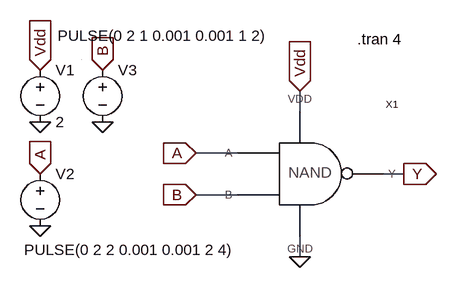
[diagram p0: schematic NAND_SYM_TESTING.asc]
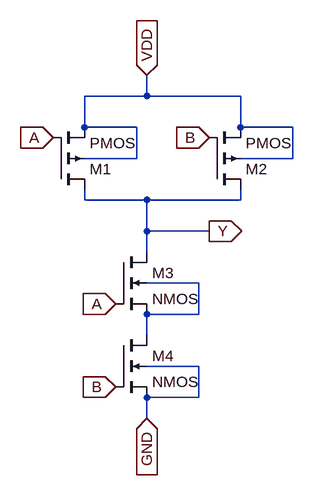
[diagram p1: sub-circuit nand_sym.asc]
NAND_SYM_TESTING.asc, the LTspice schematic file:
Version 4
SHEET 1 880 680
WIRE 336 80 336 48
WIRE 240 144 176 144
WIRE 496 176 464 176
WIRE 240 208 176 208
WIRE 336 304 336 272
WIRE 0 0 0 0
FLAG -64 16 Vdd
IOPIN -64 16 In
FLAG -64 176 A
IOPIN -64 176 In
FLAG 32 16 B
IOPIN 32 16 In
FLAG 176 144 A
IOPIN 176 144 In
FLAG 176 208 B
IOPIN 176 208 In
FLAG -64 96 0
FLAG -64 256 0
FLAG 32 96 0
FLAG 336 48 Vdd
IOPIN 336 48 In
FLAG 336 304 0
FLAG 496 176 Y
IOPIN 496 176 Out
SYMBOL voltage -64 0 R0
WINDOW 123 0 0 Left 0
WINDOW 39 0 0 Left 0
SYMATTR InstName V1
SYMATTR Value 2
SYMBOL voltage -64 160 R0
WINDOW 3 -25 133 Left 2
WINDOW 123 0 0 Left 0
WINDOW 39 0 0 Left 0
SYMATTR Value PULSE(0 2 2 0.001 0.001 2 4)
SYMATTR InstName V2
SYMBOL voltage 32 0 R0
WINDOW 3 -69 -37 Left 2
WINDOW 123 0 0 Left 0
WINDOW 39 0 0 Left 0
SYMATTR Value PULSE(0 2 1 0.001 0.001 1 2)
SYMATTR InstName V3
SYMBOL NAND_SYM 352 176 R0
SYMATTR InstName X1
TEXT 424 -32 Left 2 !.tran 4

nand_sym.asc, the sub-circuit schematic file:
Version 4
SHEET 1 880 680
WIRE 208 -48 208 -80
WIRE 208 -48 112 -48
WIRE 352 -48 208 -48
WIRE 112 0 112 -48
WIRE 192 0 112 0
WIRE 352 0 352 -48
WIRE 432 0 352 0
WIRE 192 48 192 0
WIRE 192 48 112 48
WIRE 432 48 432 0
WIRE 432 48 352 48
WIRE 112 112 112 96
WIRE 208 112 112 112
WIRE 352 112 352 96
WIRE 352 112 208 112
WIRE 208 160 208 112
WIRE 304 160 208 160
WIRE 208 192 208 160
WIRE 288 240 208 240
WIRE 288 288 288 240
WIRE 288 288 208 288
WIRE 208 320 208 288
WIRE 288 368 208 368
WIRE 288 416 288 368
WIRE 288 416 208 416
WIRE 208 448 208 416
FLAG 208 -80 VDD
IOPIN 208 -80 In
FLAG 64 16 A
IOPIN 64 16 In
FLAG 160 272 A
IOPIN 160 272 In
FLAG 160 400 B
IOPIN 160 400 In
FLAG 304 16 B
IOPIN 304 16 In
FLAG 208 448 GND
IOPIN 208 448 In
FLAG 304 160 Y
IOPIN 304 160 Out
SYMBOL pmos4 64 96 M180
SYMATTR InstName M1
SYMBOL pmos4 304 96 M180
SYMATTR InstName M2
SYMBOL nmos4 160 192 R0
SYMATTR InstName M3
SYMBOL nmos4 160 320 R0
SYMATTR InstName M4

The netlist it stands for:
* NAND_SYM_TESTING.asc
V1 Vdd 0 2
V2 A 0 PULSE(0 2 2 0.001 0.001 2 4)
V3 B 0 PULSE(0 2 1 0.001 0.001 1 2)
XX1 A B Vdd 0 Y nand_sym

* block symbol definitions
.subckt nand_sym A B VDD GND Y
M1 Y A VDD VDD PMOS
M2 Y B VDD VDD PMOS
M3 Y A N001 N001 NMOS
M4 N001 B GND GND NMOS
.ends nand_sym

.model NMOS NMOS
.model PMOS PMOS
.lib standard.mos
.tran 4
.backanno
.end